# EAGLE design opencanusb (EAGLE 9.6.2)

## Sheet 1 of 2
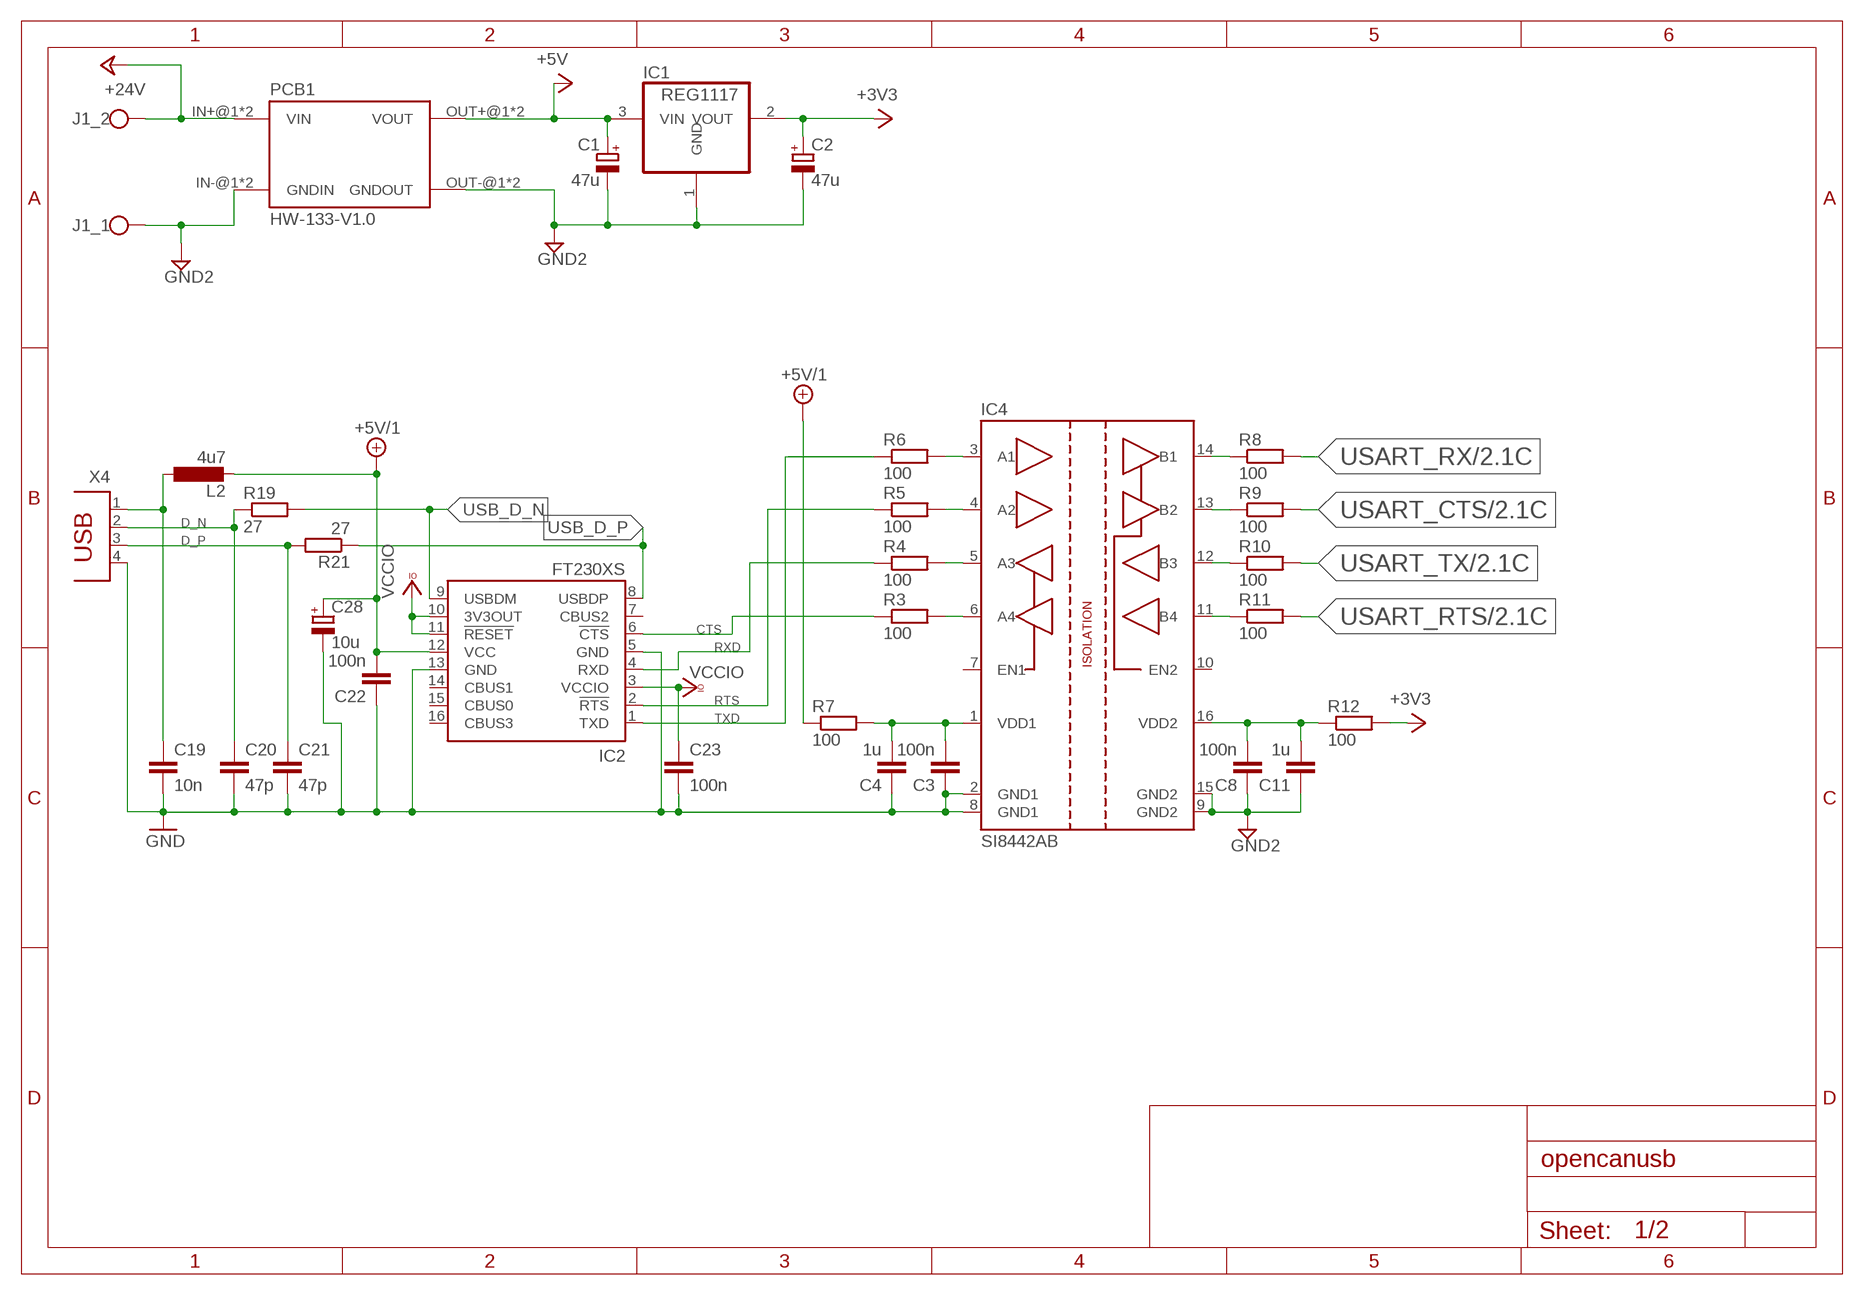
[diagram p0: schematic, sheet 1]

### Parts
C1  47u  CPOL-EUE1.8-4  [E1,8-4]
C2  47u  CPOL-EUE1.8-4  [E1,8-4]
C3  100n  C-EUC0805  [C0805]
C4  1u  C-EUC0805  [C0805]
C8  100n  C-EUC0805  [C0805]
C11  1u  C-EUC0805  [C0805]
C19  10n  C-EUC0402  [C0402]
C20  47p  C-EUC0603  [C0603]
C21  47p  C-EUC0603  [C0603]
C22  100n  C-EUC0805  [C0805]
C23  100n  C-EUC0805  [C0805]
C28  10u  CPOL-EUSMCA  [SMC_A]
IC1  REG1117  [SOT223]
IC2  FT230XS  [SSOP16]
IC4  SI8442AB  [SOIC127P1030X265-16N]
J1  DG300-7.5  [DG300-7.5]
L2  4u7  L-EUL1812  [L1812]
PCB1  HW-133-V1.0  [HW-133]
R3  100  R-EU_R0603  [R0603]
R4  100  R-EU_R0603  [R0603]
R5  100  R-EU_R0603  [R0603]
R6  100  R-EU_R0603  [R0603]
R7  100  R-EU_R0603  [R0603]
R8  100  R-EU_R0603  [R0603]
R9  100  R-EU_R0603  [R0603]
R10  100  R-EU_R0603  [R0603]
R11  100  R-EU_R0603  [R0603]
R12  100  R-EU_R0603  [R0603]
R19  27  R-EU_R0805  [R0805]
R21  27  R-EU_R0805  [R0805]
X4  PN61729  [PN61729]

### Nets
+3V3: C2.+ IC1.2(VOUT) R12.2 ; also sheet 2
+5V: C1.+ IC1.3(VIN) PCB1.OUT+@1(VOUT) PCB1.OUT+@2(VOUT)
+5V/1: C22.2 C28.+ IC2.12(VCC) L2.2 R7.1
+24V [+24V]: J1.P$2 PCB1.IN+@1(VIN) PCB1.IN+@2(VIN)
CTS [signal]: IC2.6(!CTS) R3.1
D_N: C20.1 R19.1 X4.2
D_P: C21.1 R21.2 X4.3
GND: C3.1 C4.1 C19.2 C20.2 C21.2 C22.1 C23.2 C28.- IC2.5(GND) IC2.13(GND) IC4.2(GND1) IC4.8(GND1) X4.4
GND2: C1.- C2.- C8.1 C11.1 IC1.1(GND) IC4.9(GND2) IC4.15(GND2) J1.P$1 PCB1.IN-@1(GNDIN) PCB1.IN-@2(GNDIN) PCB1.OUT-@1(GNDOUT) PCB1.OUT-@2(GNDOUT) ; also sheet 2
N$9: IC4.6(A4) R3.2
N$12: C3.2 C4.2 IC4.1(VDD1) R7.2
N$13: IC4.5(A3) R4.2
N$14: IC4.4(A2) R5.2
N$15: IC4.3(A1) R6.2
N$16: C8.2 C11.2 IC4.16(VDD2) R12.1
N$18: IC4.14(B1) R8.1
N$19: IC4.13(B2) R9.1
N$20: IC4.12(B3) R10.1
N$21: IC4.11(B4) R11.1
N$25: C19.1 L2.1 X4.1
RTS [signal]: IC2.2(!RTS) R5.1
RXD [signal]: IC2.4(RXD) R4.1
TXD [signal]: IC2.1(TXD) R6.1
USART_CTS [signal]: R9.2 ; also sheet 2
USART_RTS [signal]: R11.2 ; also sheet 2
USART_RX [signal]: R8.2 ; also sheet 2
USART_TX [signal]: R10.2 ; also sheet 2
USB_D_N [signal]: IC2.9(USBDM) R19.2
USB_D_P [signal]: IC2.8(USBDP) R21.1
VCCIO: C23.1 IC2.3(VCCIO) IC2.10(3V3OUT) IC2.11(!RESET)
Unconnected: IC2.7(CBUS2) IC2.14(CBUS1) IC2.15(CBUS0) IC2.16(CBUS3) IC4.7(EN1) IC4.10(EN2)

## Sheet 2 of 2
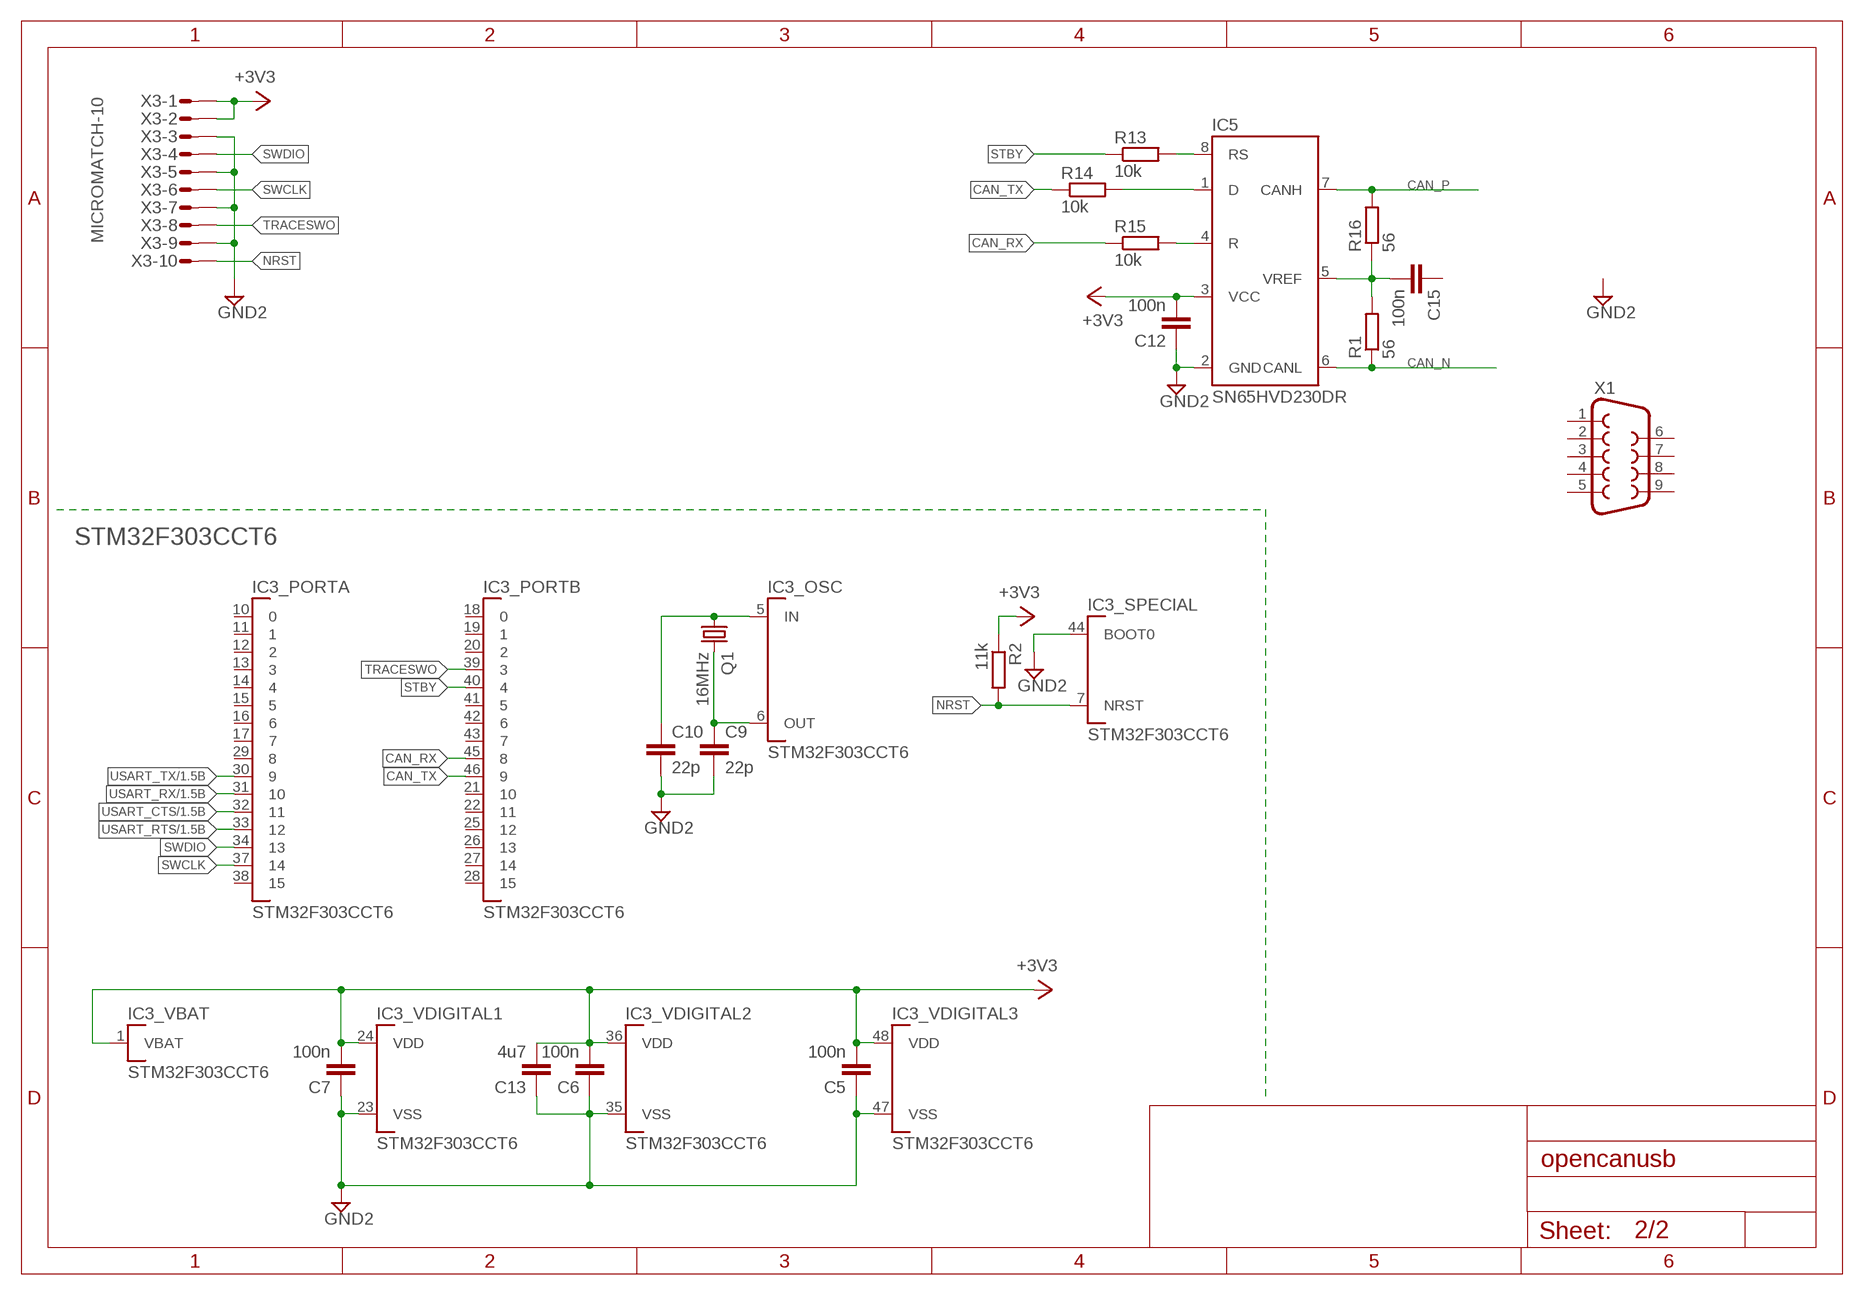
[diagram p1: schematic, sheet 2]

### Parts
C5  100n  C-EUC0805  [C0805]
C6  100n  C-EUC0805  [C0805]
C7  100n  C-EUC0805  [C0805]
C9  22p  C-EUC0805  [C0805]
C10  22p  C-EUC0805  [C0805]
C12  100n  C-EUC0402  [C0402]
C13  4u7  C-EUC0805  [C0805]
C15  100n  C-EUC0805  [C0805]
IC3  STM32F303CCT6  [QFP50P900X900X160-48N]
IC5  SN65HVD230DR  [SOIC127P599X175-8N]
Q1  16MHz  CRYSTALHC49UP  [HC49UP]
R1  56  R-EU_R1206  [R1206]
R2  11k  R-EU_R1206  [R1206]
R13  10k  R-EU_R1206  [R1206]
R14  10k  R-EU_R1206  [R1206]
R15  10k  R-EU_R1206  [R1206]
R16  56  R-EU_R1206  [R1206]
X1  F09HP  [F09HP]
X3  MICROMATCH-10  [MICROMATCH-10]

### Nets
+3V3: C5.2 C6.2 C7.2 C12.2 C13.2 IC3.1(_VBAT:VBAT) IC3.24(_VDIGITAL1:VDD) IC3.36(_VDIGITAL2:VDD) IC3.48(_VDIGITAL3:VDD) IC5.3(VCC) R2.1 X3.1 X3.2 ; also sheet 1
CAN_N [signal]: IC5.6(CANL) R1.1
CAN_P [signal]: IC5.7(CANH) R16.2
CAN_RX [signal]: IC3.45 R15.1
CAN_TX [signal]: IC3.46 R14.1
GND2: C5.1 C6.1 C7.1 C9.2 C10.2 C12.1 C13.1 IC3.23(_VDIGITAL1:VSS) IC3.35(_VDIGITAL2:VSS) IC3.44(_SPECIAL:BOOT0) IC3.47(_VDIGITAL3:VSS) IC5.2(GND) X3.3 X3.5 X3.7 X3.9 ; also sheet 1
N$1: C15.2 IC5.5(VREF) R1.2 R16.1
N$3 [signal]: IC5.8(RS) R13.2
N$4 [signal]: IC5.1(D) R14.2
N$5 [signal]: IC5.4(R) R15.2
N$10: C9.1 IC3.6(_OSC:OUT) Q1.2
N$11: C10.1 IC3.5(_OSC:IN) Q1.1
NRST: IC3.7(_SPECIAL:NRST) R2.2 X3.10
STBY [signal]: IC3.40 R13.1
SWCLK [signal]: IC3.37 X3.6
SWDIO [signal]: IC3.34 X3.4
TRACESWO [signal]: IC3.39 X3.8
USART_CTS [signal]: IC3.32 ; also sheet 1
USART_RTS [signal]: IC3.33 ; also sheet 1
USART_RX [signal]: IC3.31 ; also sheet 1
USART_TX [signal]: IC3.30 ; also sheet 1
Unconnected: C15.1 IC3.2 IC3.3 IC3.4 IC3.10 IC3.11 IC3.12 IC3.13 IC3.14 IC3.15 IC3.16 IC3.17 IC3.18 IC3.19 IC3.20 IC3.21 IC3.22 IC3.25 IC3.26 IC3.27 IC3.28 IC3.29 IC3.38 IC3.41 IC3.42 IC3.43 X1.1 X1.2 X1.3 X1.4 X1.5 X1.6 X1.7 X1.8 X1.9

### Notes on the sheet
- STM32F303CCT6

## Power pins joined to a net without a drawn wire
VDDA: IC3.9(_VANALOG:VDDA)
VSSA: IC3.8(_VANALOG:VSSA)

## Library data of the parts
C1 C2 C28 = rcl:CPOL-EU: POLARIZED CAPACITOR, European symbol; SPICEPREFIX: C
C3-C13 C15 C19-C23 = rcl:C-EU: CAPACITOR, European symbol; SPICEPREFIX: C
IC1 = burr-brown:REG1117: 800mA and 1A Low Dropout (LDO) Positive Regulator 1.8V, 2.5V, 2.85V, 3.3V, 5V, and Adj; MPN: REG1117; OC_FARNELL: 1097566; OC_NEWARK: 14P6981
IC2 = ftdichip:FT230X: USB to BASIC UART IC Auto generated by make-symbol-device-package-bsdl.ulp Rev. 43 Source: Data sheet <http://www.ftdichip.com/Support/Documents/DataSheets/ICs/DS_FT230X.pdf>
IC3 = canusb:STM32F303CCT6: STM32F303xB STM32F303xC Arm®-based Cortex®-M4 32b MCU+FPU, up to 256KB Flash+ 48KB SRAM, 4 ADCs, 2 DAC ch., 7 comp, 4 PGA, timers, 2.0-3.6 V
IC4 = canusb:SI8442A: Si8440/41/42/45 LOW-POWER QUAD-CHANNEL DIGITAL ISOLATOR
IC5 = canusb:SN65HVD230DR: SN65HVD23x 3.3-V CAN Bus Transceivers
J1 = canusb:DG300-7.5: DEGSON DG300-7.5 PCB terminal block
L2 = rcl:L-EU: INDUCTOR, European symbol; SPICEPREFIX: L
PCB1 = canusb:HW-133-V1.0: HW-133 DC-DC converter
Q1 = crystal:CRYSTAL: CRYSTAL; OC_FARNELL: unknown; OC_NEWARK: unknown
R1-R16 R19 R21 = rcl:R-EU_: RESISTOR, European symbol; SPICEPREFIX: R
X1 = con-subd:F09: SUB-D; OC_FARNELL: unknown; OC_NEWARK: unknown
X3 = con-amp-micromatch:MICROMATCH-10: MicroMaTch 10 8-215464-0 / 1-215464-0 Drawing Number C-215464 DDEController.pdf; MF: FARNELL; MPN: 8-215464-0; OC_FARNELL: 3784654; OC_NEWARK: 19J6430
X4 = con-berg:PN61729: BERG USB connector; OC_FARNELL: unknown; OC_NEWARK: unknown

## Net classes
1 signal: width 0.203 mm, drill 0.4 mm, clearance 0.203 mm
2 +24V: clearance 1.016 mm

## Board
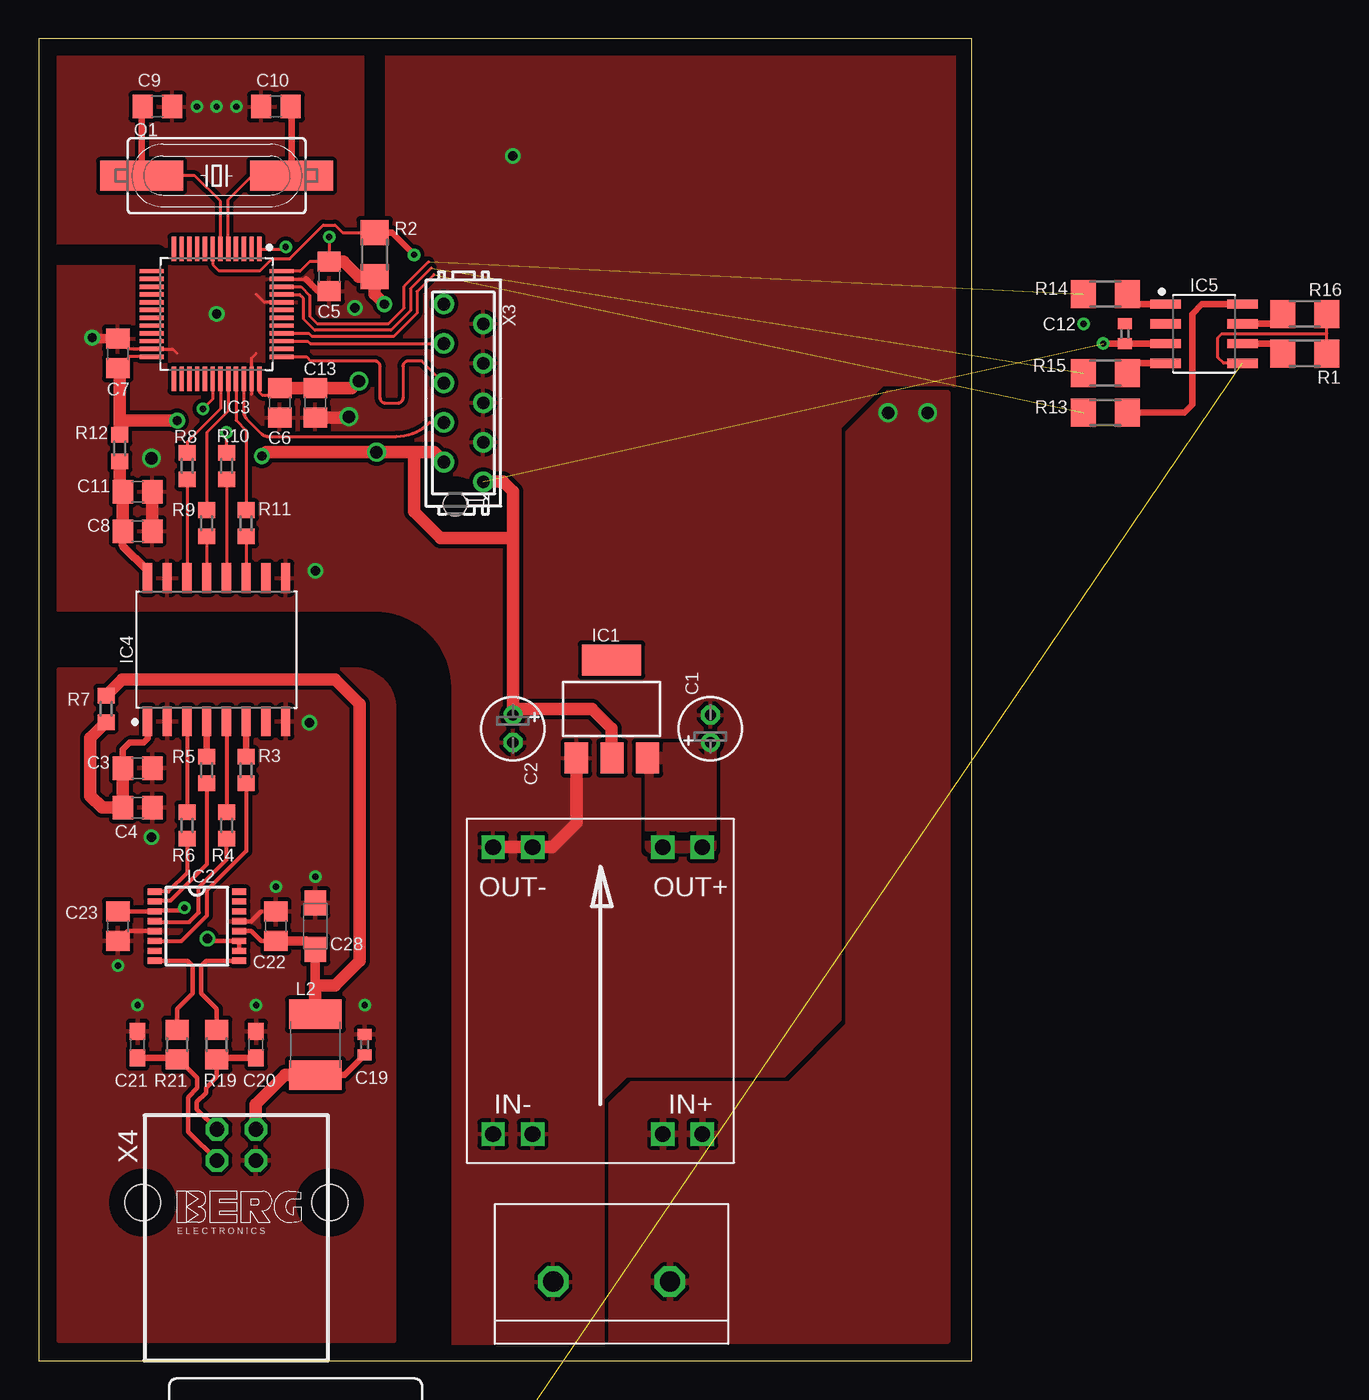
[diagram p2: board, top side]
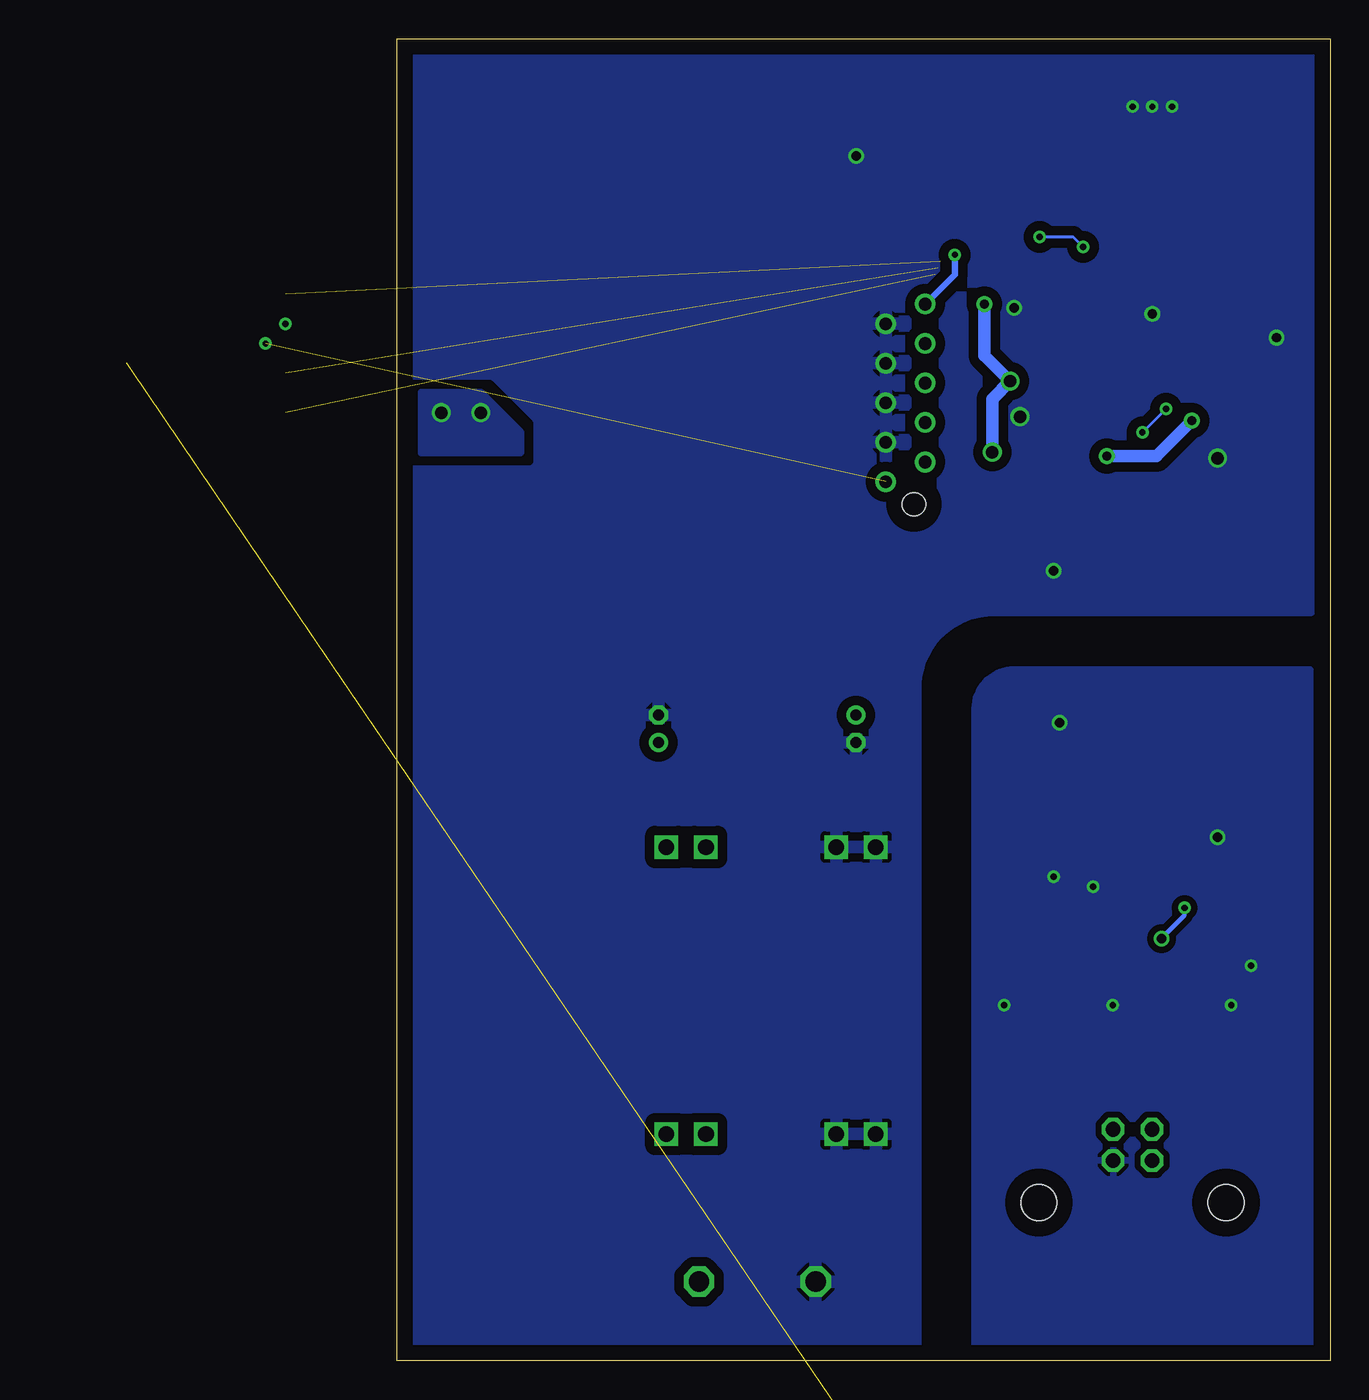
[diagram p3: board, bottom side, seen from below]

Size 60 x 85 mm. Coordinates in mm from the lower left corner, seen from the top.
Outline: 0,0 60,0 60,85 0,85 0,0
Copper layers (1*16): Top 0.035mm / dielectric 1.5mm / Bottom 0.035mm
Design rules "default *": minimum track width 6mil, minimum drill 0.35mm, track to track 6mil, track to pad 6mil, pad to pad 6mil, via to via 6mil, smd to smd 6mil, copper to edge 40mil, drill to drill 6mil, minimum pad ring 10mil, minimum via ring 8mil, stop-mask expansion 4mil, vias tented up to drill 0.4mm, thermal gap 10mil
tRestrict: 2 lines

### Footprints (pad centres in the part's own frame; a part is rotated, then mirrored left to right if it is on the bottom)
E1,8-4 = drill 0.711 pad 1.168: + -0.889,0 | drill 0.711 pad 1.168 octagon: - 0.889,0
C0805 = smd 1.3 x 1.5: 1 -0.95,0; 2 0.95,0
C0402 = smd 0.7 x 0.9: 1 -0.65,0; 2 0.65,0
C0603 = smd 1.1 x 1: 1 -0.85,0; 2 0.85,0
SMC_A = smd 1.6 x 1.4: + -1.5,0; - 1.5,0
SOT223 = smd 1.499 x 2.007: 1 -2.261,-3.15; 2 0.025,-3.15; 3 2.311,-3.15 | smd 3.81 x 2.007: 4 0,3.15
SSOP16 = smd 0.914 x 0.406: 1 -2.718,2.223; 2 -2.718,1.587; 3 -2.718,0.953; 4 -2.718,0.318; 5 -2.718,-0.318; 6 -2.718,-0.953; 7 -2.718,-1.587; 8 -2.718,-2.223; 9 2.718,-2.223; 10 2.718,-1.587; 11 2.718,-0.953; 12 2.718,-0.318; 13 2.718,0.318; 14 2.718,0.953; 15 2.718,1.587; 16 2.718,2.223
QFP50P900X900X160-48N = smd 1.559 x 0.28: 1 -4.178,2.75; 2 -4.178,2.25; 3 -4.178,1.75; 4 -4.178,1.25; 5 -4.178,0.75; 6 -4.178,0.25; 7 -4.178,-0.25; 8 -4.178,-0.75; 9 -4.178,-1.25; 10 -4.178,-1.75; 11 -4.178,-2.25; 12 -4.178,-2.75; 25 4.178,-2.75; 26 4.178,-2.25; 27 4.178,-1.75; 28 4.178,-1.25; 29 4.178,-0.75; 30 4.178,-0.25; 31 4.178,0.25; 32 4.178,0.75; 33 4.178,1.25; 34 4.178,1.75; 35 4.178,2.25; 36 4.178,2.75 | smd 0.28 x 1.559: 13 -2.75,-4.178; 14 -2.25,-4.178; 15 -1.75,-4.178; 16 -1.25,-4.178; 17 -0.75,-4.178; 18 -0.25,-4.178; 19 0.25,-4.178; 20 0.75,-4.178; 21 1.25,-4.178; 22 1.75,-4.178; 23 2.25,-4.178; 24 2.75,-4.178; 37 2.75,4.178; 38 2.25,4.178; 39 1.75,4.178; 40 1.25,4.178; 41 0.75,4.178; 42 0.25,4.178; 43 -0.25,4.178; 44 -0.75,4.178; 45 -1.25,4.178; 46 -1.75,4.178; 47 -2.25,4.178; 48 -2.75,4.178
SOIC127P1030X265-16N = smd 1.901 x 0.599: 1 -4.605,4.445; 2 -4.605,3.175; 3 -4.605,1.905; 4 -4.605,0.635; 5 -4.605,-0.635; 6 -4.605,-1.905; 7 -4.605,-3.175; 8 -4.605,-4.445; 9 4.605,-4.445; 10 4.605,-3.175; 11 4.605,-1.905; 12 4.605,-0.635; 13 4.605,0.635; 14 4.605,1.905; 15 4.605,3.175; 16 4.605,4.445
SOIC127P599X175-8N = smd 1.967 x 0.599: 1 -2.469,1.905; 2 -2.469,0.635; 3 -2.469,-0.635; 4 -2.469,-1.905; 5 2.469,-1.905; 6 2.469,-0.635; 7 2.469,0.635; 8 2.469,1.905
DG300-7.5 = drill 1.3 octagon: P$1 -3.75,0; P$2 3.75,0
L1812 = smd 1.9 x 3.4: 1 -1.95,0; 2 1.95,0
HW-133 = drill 1 square: IN+@1 10.922,-18.452; IN+@2 13.462,-18.452; IN-@1 0,-18.452; IN-@2 2.54,-18.452; OUT+@1 10.922,0; OUT+@2 13.462,0; OUT-@1 0,0; OUT-@2 2.54,0
HC49UP = smd 5.334 x 1.93: 1 -4.826,0; 2 4.826,0
R1206 = smd 1.6 x 1.803: 1 -1.422,0; 2 1.422,0
R0603 = smd 1 x 1.1: 1 -0.85,0; 2 0.85,0
R0805 = smd 1.3 x 1.5: 1 -0.95,0; 2 0.95,0
F09HP = drill 1.016 octagon: 1 -5.486,-1.27; 2 -2.743,-1.27; 3 0,-1.27; 4 2.743,-1.27; 5 5.486,-1.27; 6 -4.115,1.27; 7 -1.372,1.27; 8 1.372,1.27; 9 4.115,1.27 | drill 3.302 pad 5.08: G1 -12.522,0; G2 12.522,0
MICROMATCH-10 = drill 0.813: 1 5.715,1.27; 2 4.445,-1.27; 3 3.175,1.27; 4 1.905,-1.27; 5 0.635,1.27; 6 -0.635,-1.27; 7 -1.905,1.27; 8 -3.175,-1.27; 9 -4.445,1.27; 10 -5.715,-1.27 | hole 1.5: 7.16,-0.55
PN61729 = drill 0.95 octagon: 1 1.25,4.71; 2 -1.25,4.71; 3 -1.25,2.71; 4 1.25,2.71 | hole 2.3: -6.02,0; 6.02,0

### Placement (x,y rotation side)
C1  43.18,40.64 90 top
C2  30.48,40.64 270 top
C3  6.35,38.1 180 top
C4  6.35,35.56 180 top
C5  18.67,69.72 90 top
C6  15.49,61.59 90 top
C7  5.08,64.77 270 top
C8  6.35,53.34 180 top
C9  7.62,80.64 0 top
C10  15.24,80.64 180 top
C11  6.35,55.88 180 top
C12  69.85,66.04 270 top  (outside the outline)
C13  17.78,61.59 90 top
C15  2.54,-44.45 0 top  (outside the outline)
C19  20.95,20.32 90 top
C20  13.97,20.32 90 top
C21  6.35,20.32 90 top
C22  15.24,27.94 270 top
C23  5.08,27.94 270 top
C28  17.78,27.94 90 top
IC1  36.83,41.91 0 top
IC2  10.16,27.94 0 top
IC3  11.43,67.31 270 top
IC4  11.43,45.72 90 top
IC5  74.93,66.04 0 top  (outside the outline)
J1  36.83,5.08 0 top
L2  17.78,20.32 90 top
PCB1  29.21,33.02 0 top
Q1  11.43,76.2 180 top
R1  81.41,64.77 0 top  (outside the outline)
R2  21.59,71.12 90 top
R3  13.34,37.97 90 top
R4  12.06,34.42 90 top
R5  10.79,37.97 90 top
R6  9.53,34.42 90 top
R7  4.32,41.91 270 top
R8  9.53,57.53 90 top
R9  10.79,53.85 90 top
R10  12.06,57.53 90 top
R11  13.34,53.85 90 top
R12  5.21,58.67 90 top
R13  68.58,60.96 0 top  (outside the outline)
R14  68.58,68.58 0 top  (outside the outline)
R15  68.58,63.5 0 top  (outside the outline)
R16  81.41,67.31 180 top  (outside the outline)
R19  11.43,20.32 90 top
R21  8.89,20.32 270 top
X1  16.51,-19.05 0 top  (outside the outline)
X3  27.3,62.23 270 top
X4  12.7,10.16 0 top

### Tracks (layer width: path | path; a pad name or v marks a point on that pad's centre or on a via)
+3V3  (via drill 0.4, 0.6, 0.8)  (1 unrouted)
  Top 0.203: IC3.36 14.18,62.27 14.35,62.1 15.05,62.1 C6.2 | IC3.24 5.82,64.56 C7.2 | IC3.48 16.79,70.06 17.4,70.67 C5.2 v18.67,72.26 | IC3.1 15.73,71.49 v15.88,71.63
  Top 0.406: v68.45,65.41 68.47,65.39 C12.2 72.45,65.39 IC5.3
  Top 0.813: IC1.2 36.83,38.79 36.83,40.64 35.56,41.91 30.86,41.91 C2.+ 30.48,52.9 | 24.13,58.42 v21.72,58.42 14.61,58.42 v14.35,58.17 | 24.13,58.42 25.4,58.42 X3.2 | C7.2 5.21,63.69 5.21,60.45 | 5.21,60.45 R12.2 | v8.89,60.45 5.21,60.45 | v22.23,67.94 21.59,68.58 R2.1 20.57,69.7 19.6,70.67 C5.2 | 24.13,58.42 24.13,54.61 25.84,52.9 30.48,52.9 | X3.1 29.84,56.52 30.48,55.88 30.48,52.9 | v20.57,62.99 20.13,62.55 C13.2 C6.2
  Bottom 0.203: v15.88,71.63 16.51,72.26 v18.67,72.26
  Bottom 0.813: v14.35,58.17 11.18,58.17 v8.89,60.45 | v22.23,67.94 22.23,64.64 v20.57,62.99 21.72,61.85 v21.72,58.42
+5V
  pour Top (isolate 0.813): 39.37,33.02 43.18,33.02 43.18,39.37 39.37,39.37
+5V/1
  Top 0.305: IC2.12 13.65,27.62 14.29,26.99 C22.2
  Top 0.61: 17.78,24.13 C28.+ 17.23,26.99 C22.2
  Top 0.813: L2.2 17.78,24.13 19.05,24.13 20.64,25.72 20.64,42.23 19.05,43.81 5.37,43.81 R7.1
+24V  (via drill 0.8)
  other vias: 54.61,60.96 57.15,60.96
  pour Top (isolate 0.813): 36.83,1.27 36.83,16.51 38.1,17.78 48.26,17.78 52.07,21.59 52.07,59.69 54.61,62.23 58.42,62.23 58.42,1.27
  pour Bottom: 52.07,58.42 52.07,59.69 54.61,62.23 58.42,62.23 58.42,58.42
CAN_N
  Top 0.406: IC5.6 79.35,65.41 R1.1
CAN_P
  Top 0.406: IC5.7 79.35,66.67 R16.2
CAN_RX  (1 unrouted)
  Top 0.203: IC3.45 16.78,68.56 17.02,68.33 17.02,66.99 17.74,66.27 22.65,66.27 23.9,67.52 23.9,68.93 25.23,70.26
CAN_TX  (1 unrouted)
  Top 0.203: IC3.46 16.86,69.06 17.42,68.49 17.42,67.16 17.91,66.67 22.48,66.67 23.5,67.69 23.5,69.09 25.06,70.66
CTS
  Top 0.254: R3.1 13.34,32.77 10.79,30.23 10.79,28.6 9.18,26.99 IC2.6
D_N
  Top 0.305: X4.2 10.16,16.16 10.16,16.64 10.74,17.22 10.74,17.55 11.43,18.24 R19.1
  Top 0.406: C20.1 11.53,19.47 R19.1
D_P
  Top 0.305: X4.3 9.6,14.72 9.6,16.94 10.19,17.52 10.19,18.18 8.99,19.37
  Top 0.406: R21.2 8.99,19.37 8.89,19.47 C21.1
GND  (via drill 0.4, 0.6)
  Top 0.305: IC2.13 13.65,28.26 14.29,28.89 | IC2.5 5.71,27.62 C23.2
  other vias: 20.95,22.86 13.97,22.86 6.35,22.86 5.08,25.4 17.78,31.11 15.24,30.48 7.24,33.66 17.4,41.02
  pour Bottom (isolate 0.406): 1.27,44.45 20.32,44.45 arc-90 22.86,41.91 22.86,0 1.27,0
  pour Top (isolate 0.254): 1.27,44.45 20.32,44.45 arc-90 22.86,41.91 22.86,1.27 1.27,1.27
GND2  (via drill 0.4, 0.6, 0.8)
  Top 0.203: C7.1 5.74,65.06 IC3.23 8.6,65.06 8.89,64.77 | 13.68,62.14 IC3.35 13.68,64.48 13.97,64.77 | 15.17,60.65 C6.1 | 18.48,68.77 C5.1 18.61,68.83 17.96,68.83 17.96,68.79 | IC3.44 14.49,68.06 13.97,68.58 | IC3.47 17.19,69.56
  Top 0.406: 67.2,66.69 v67.18,66.67 | 17.19,69.56 17.96,68.79
  Top 0.61: C7.1 3.5,65.72 v3.43,65.79
  Top 0.813: IC1.1 34.57,34.57 33.02,33.02 PCB1.OUT-@2 PCB1.OUT-@1 | C8.1 C11.1 | C13.1 19.88,60.65 v19.94,60.71
  other vias: 20.32,67.69 11.43,67.31 10.16,80.64 12.7,80.64 11.43,80.64 17.78,50.8 30.48,77.47 7.24,58.04
  pour Bottom (isolate 0.61, rank 2): 1.27,85.09 59.69,85.09 59.69,0 26.67,0 26.67,43.26 arc90 21.67,48.26 1.27,48.26
  pour Top (isolate 0.254, rank 2): 1.27,83.82 59.69,83.82 59.69,0 26.67,0 26.67,43.26 arc90 21.67,48.26 1.27,48.26
N$1  (1 unrouted)
  Top 0.203: IC5.5 76.2,64.14 75.82,64.52 75.82,65.79 76.07,66.04 82.8,66.04 82.83,66.06 | 82.83,66.06 R16.1 | R1.2 82.83,66.06
N$3
  Top 0.406: IC5.8 74.8,67.94 74.17,67.31 74.17,61.47 73.66,60.96 R13.2
N$4
  Top 0.406: IC5.1 70.64,67.94 R14.2
N$5
  Top 0.406: IC5.4 70.64,64.14 R15.2
N$9
  Top 0.406: IC4.6 R3.2
N$10
  Top 0.203: IC3.6 11.68,74.55 10.03,76.2 Q1.2
  Top 0.406: C9.1 6.6,80.58 Q1.2
N$11
  Top 0.203: IC3.5 12.18,74.66 13.72,76.2 Q1.1
  Top 0.406: C10.1 16.26,80.58 Q1.1
N$12
  Top 0.406: IC4.1 6.99,40.01 6.73,39.75 5.84,39.75 5.4,39.31 C3.2
  Top 0.813: C3.2 C4.2 4.06,35.56 3.3,36.32 3.3,40.04 R7.2
N$13
  Top 0.254: IC4.5 R4.2
N$14
  Top 0.406: IC4.4 R5.2
N$15
  Top 0.254: IC4.3 R6.2
N$16
  Top 0.508: IC4.16 6.99,50.8 5.4,52.38 C8.2
  Top 0.813: C8.2 C11.2 5.21,56.07 R12.1
N$18
  Top 0.203: R8.1 IC4.14
N$19
  Top 0.203: R9.1 IC4.13
N$20
  Top 0.203: R10.1 IC4.12
N$21
  Top 0.203: R11.1 IC4.11
N$25
  Top 0.406: C19.1 19.66,18.37 L2.1
  Top 0.813: X4.1 13.95,16.49 15.83,18.37 L2.1
NRST  (via drill 0.4)
  Top 0.203: IC3.7 11.18,70.48 11.56,70.1 14.22,70.1 14.99,70.87 16.13,70.87 18.29,73.03 19.05,73.03 19.53,72.54 R2.2
  Top 0.406: v24.13,71.12 22.71,72.54 R2.2
  Bottom 0.406: X3.10 24.13,69.85 v24.13,71.12
RTS
  Top 0.254: IC2.2 7.49,29.58 8.45,29.58 10.79,31.92 R5.1
RXD
  Top 0.254: IC2.4 7.49,28.21 9.68,28.21 10.29,28.81 10.29,30.44 12.06,32.22 R4.1
STBY  (1 unrouted)
  Top 0.203: 25.4,69.85 24.31,68.76 24.31,67.35 22.82,65.86 17.57,65.86 17.37,66.06 IC3.40
SWCLK
  Top 0.203: IC3.37 17.21,64.56 17.49,64.29 21.59,64.29 arc-90 21.95,63.93 21.95,61.91 arc90 22.3,61.56 23.06,61.56 arc90 23.41,61.91 23.41,63.93 arc-90 23.77,64.29 24.61,64.29 X3.6
SWDIO
  Top 0.203: IC3.34 13.18,61 arc45 13.37,60.55 14.29,59.62 arc45 14.74,59.44 22.98,59.44 arc45 25.12,60.33 X3.4
TRACESWO
  Top 0.203: IC3.39 17.3,65.56 17.45,65.41 X3.8
TXD
  Top 0.254: IC2.1 8.32,30.16 9.53,31.37 R6.1
USART_CTS
  Top 0.203: IC3.32 12.18,61.08 10.79,59.69 R9.2
USART_RTS
  Top 0.203: IC3.33 12.68,60.47 13.34,59.82 R11.2
USART_RX
  Top 0.203: IC3.31 11.68,61.21 9.53,59.05 R8.2
USART_TX  (via drill 0.4)
  Top 0.203: R10.2 v12.06,59.69 | IC3.30 11.18,61.84 v10.55,61.21
  Bottom 0.203: v10.55,61.21 v12.06,59.69
USB_D_N
  Top 0.305: R19.2 11.43,22.63 10.44,23.62 10.44,25.4 10.76,25.72 IC2.9
USB_D_P
  Top 0.305: R21.1 8.89,22.63 9.88,23.62 9.88,25.4 9.56,25.72 IC2.8
VCCIO  (via drill 0.4, 0.6)
  Top 0.254: IC2.3 7.49,28.94 | 9.25,29.12 v9.36,29.12
  Top 0.305: IC2.3 C23.1 | IC2.10 IC2.11 10.99,26.99 v10.84,27.14 | 7.49,28.94 9.07,28.94 9.25,29.12
  Bottom 0.305: v10.84,27.14 9.36,28.62 v9.36,29.12